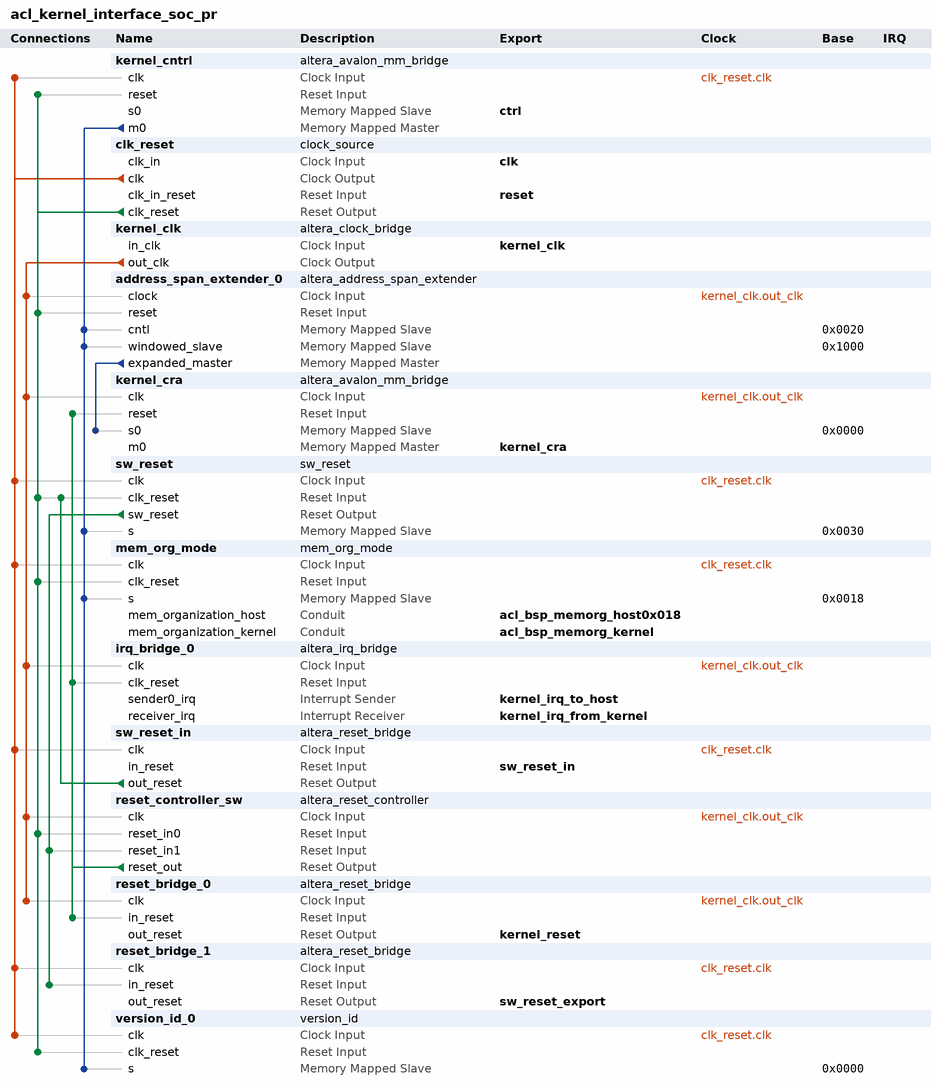
[diagram p0: system contents]
# Platform Designer (Qsys) system acl_kernel_interface_soc_pr, Arria 10 10AS066N3F40E2SG
# Parameters at their usual value, and those the tool derives, are not listed.
package require -exact qsys 1.0
create_system acl_kernel_interface_soc_pr
set_project_property DEVICE_FAMILY {Arria 10}
set_project_property DEVICE 10AS066N3F40E2SG

add_component kernel_cntrl ip/acl_kernel_interface_soc_pr/acl_kernel_interface_soc_pr_kernel_cntrl.ip altera_avalon_mm_bridge kernel_cntrl 17.1
load_component kernel_cntrl
set_component_parameter_value DATA_WIDTH 32
set_component_parameter_value ADDRESS_WIDTH 14
set_component_parameter_value USE_AUTO_ADDRESS_WIDTH 1
set_component_parameter_value ADDRESS_UNITS SYMBOLS
set_component_parameter_value MAX_PENDING_RESPONSES 1
save_component

add_component clk_reset ip/acl_kernel_interface_soc_pr/acl_kernel_interface_soc_pr_clk_reset.ip clock_source clk_reset 
load_component clk_reset
set_component_parameter_value clockFrequency 100000000
set_component_parameter_value resetSynchronousEdges DEASSERT
save_component

add_component kernel_clk ip/acl_kernel_interface_soc_pr/acl_kernel_interface_soc_pr_kernel_clk.ip altera_clock_bridge kernel_clk 17.1
load_component kernel_clk
set_component_parameter_value DERIVED_CLOCK_RATE 400000000
set_component_parameter_value EXPLICIT_CLOCK_RATE 0
save_component

add_component address_span_extender_0 ip/acl_kernel_interface_soc_pr/acl_kernel_interface_soc_pr_address_span_extender_0.ip altera_address_span_extender address_span_extender_0 17.1
load_component address_span_extender_0
set_component_parameter_value DATA_WIDTH 32
set_component_parameter_value MASTER_ADDRESS_WIDTH 30
set_component_parameter_value SLAVE_ADDRESS_WIDTH 10
set_component_parameter_value BURSTCOUNT_WIDTH 1
set_component_parameter_value MASTER_ADDRESS_DEF 0
set_component_parameter_value ENABLE_SLAVE_PORT true
set_component_parameter_value MAX_PENDING_READS 1
save_component

add_component kernel_cra ip/acl_kernel_interface_soc_pr/acl_kernel_interface_soc_pr_kernel_cra.ip altera_avalon_mm_bridge kernel_cra 17.1
load_component kernel_cra
set_component_parameter_value DATA_WIDTH 64
set_component_parameter_value ADDRESS_WIDTH 30
set_component_parameter_value USE_AUTO_ADDRESS_WIDTH 0
set_component_parameter_value ADDRESS_UNITS SYMBOLS
set_component_parameter_value MAX_PENDING_RESPONSES 1
save_component

add_component sw_reset ip/acl_kernel_interface_soc_pr/acl_kernel_interface_soc_pr_sw_reset.ip sw_reset sw_reset 10.0
load_component sw_reset
set_component_parameter_value WIDTH 64
set_component_parameter_value LOG2_RESET_CYCLES 10
set_component_parameter_value WIDTH_BYTES 8
save_component

add_component mem_org_mode ip/acl_kernel_interface_soc_pr/acl_kernel_interface_soc_pr_mem_org_mode.ip mem_org_mode mem_org_mode 10.0
load_component mem_org_mode
set_component_parameter_value WIDTH 32
save_component

add_component irq_bridge_0 ip/acl_kernel_interface_soc_pr/acl_kernel_interface_soc_pr_irq_bridge_0.ip altera_irq_bridge irq_bridge_0 17.1
load_component irq_bridge_0
set_component_parameter_value IRQ_WIDTH 1
save_component

add_component sw_reset_in ip/acl_kernel_interface_soc_pr/acl_kernel_interface_soc_pr_sw_reset_in.ip altera_reset_bridge sw_reset_in 17.1
load_component sw_reset_in
set_component_parameter_value ACTIVE_LOW_RESET 0
set_component_parameter_value SYNCHRONOUS_EDGES deassert
save_component

add_component reset_controller_sw ip/acl_kernel_interface_soc_pr/acl_kernel_interface_soc_pr_reset_controller_sw.ip altera_reset_controller reset_controller_sw 17.1
load_component reset_controller_sw
set_component_parameter_value NUM_RESET_INPUTS 2
set_component_parameter_value SYNC_DEPTH 2
set_component_parameter_value ADAPT_RESET_REQUEST 0
save_component

add_component reset_bridge_0 ip/acl_kernel_interface_soc_pr/acl_kernel_interface_soc_pr_reset_bridge_0.ip altera_reset_bridge reset_bridge_0 17.1
load_component reset_bridge_0
set_component_parameter_value ACTIVE_LOW_RESET 1
set_component_parameter_value SYNCHRONOUS_EDGES deassert
save_component

add_component reset_bridge_1 ip/acl_kernel_interface_soc_pr/acl_kernel_interface_soc_pr_reset_bridge_1.ip altera_reset_bridge reset_bridge_1 17.1
load_component reset_bridge_1
set_component_parameter_value ACTIVE_LOW_RESET 1
set_component_parameter_value SYNCHRONOUS_EDGES deassert
save_component

add_component version_id_0 ip/acl_kernel_interface_soc_pr/acl_kernel_interface_soc_pr_version_id_0.ip version_id version_id_0 10.0
load_component version_id_0
set_component_parameter_value WIDTH 32
set_component_parameter_value VERSION_ID -1598029822
save_component

# connections
add_connection clk_reset.clk kernel_cntrl.clk clock
add_connection clk_reset.clk mem_org_mode.clk clock
add_connection clk_reset.clk reset_bridge_1.clk clock
add_connection clk_reset.clk sw_reset.clk clock
add_connection clk_reset.clk sw_reset_in.clk clock
add_connection clk_reset.clk version_id_0.clk clock
add_connection kernel_clk.out_clk address_span_extender_0.clock clock
add_connection kernel_clk.out_clk irq_bridge_0.clk clock
add_connection kernel_clk.out_clk kernel_cra.clk clock
add_connection kernel_clk.out_clk reset_bridge_0.clk clock
add_connection kernel_clk.out_clk reset_controller_sw.clk clock
add_connection clk_reset.clk_reset address_span_extender_0.reset reset
add_connection clk_reset.clk_reset kernel_cntrl.reset reset
add_connection clk_reset.clk_reset mem_org_mode.clk_reset reset
add_connection clk_reset.clk_reset reset_controller_sw.reset_in0 reset
add_connection clk_reset.clk_reset sw_reset.clk_reset reset
add_connection clk_reset.clk_reset version_id_0.clk_reset reset
add_connection reset_controller_sw.reset_out irq_bridge_0.clk_reset reset
add_connection reset_controller_sw.reset_out kernel_cra.reset reset
add_connection reset_controller_sw.reset_out reset_bridge_0.in_reset reset
add_connection sw_reset.sw_reset reset_bridge_1.in_reset reset
add_connection sw_reset.sw_reset reset_controller_sw.reset_in1 reset
add_connection sw_reset_in.out_reset sw_reset.clk_reset reset
add_connection address_span_extender_0.expanded_master kernel_cra.s0 avalon
set_connection_parameter_value address_span_extender_0.expanded_master/kernel_cra.s0 baseAddress 0x0000
add_connection kernel_cntrl.m0 address_span_extender_0.cntl avalon
set_connection_parameter_value kernel_cntrl.m0/address_span_extender_0.cntl baseAddress 0x0020
add_connection kernel_cntrl.m0 address_span_extender_0.windowed_slave avalon
set_connection_parameter_value kernel_cntrl.m0/address_span_extender_0.windowed_slave baseAddress 0x1000
add_connection kernel_cntrl.m0 mem_org_mode.s avalon
set_connection_parameter_value kernel_cntrl.m0/mem_org_mode.s baseAddress 0x0018
add_connection kernel_cntrl.m0 sw_reset.s avalon
set_connection_parameter_value kernel_cntrl.m0/sw_reset.s baseAddress 0x0030
add_connection kernel_cntrl.m0 version_id_0.s avalon
set_connection_parameter_value kernel_cntrl.m0/version_id_0.s baseAddress 0x0000

# exported interfaces
add_interface acl_bsp_memorg_host0x018 conduit end
set_interface_property acl_bsp_memorg_host0x018 EXPORT_OF mem_org_mode.mem_organization_host
add_interface acl_bsp_memorg_kernel conduit end
set_interface_property acl_bsp_memorg_kernel EXPORT_OF mem_org_mode.mem_organization_kernel
add_interface clk clock sink
set_interface_property clk EXPORT_OF clk_reset.clk_in
add_interface ctrl avalon slave
set_interface_property ctrl EXPORT_OF kernel_cntrl.s0
add_interface kernel_clk clock sink
set_interface_property kernel_clk EXPORT_OF kernel_clk.in_clk
add_interface kernel_cra avalon master
set_interface_property kernel_cra EXPORT_OF kernel_cra.m0
add_interface kernel_irq_from_kernel interrupt receiver
set_interface_property kernel_irq_from_kernel EXPORT_OF irq_bridge_0.receiver_irq
add_interface kernel_irq_to_host interrupt sender
set_interface_property kernel_irq_to_host EXPORT_OF irq_bridge_0.sender0_irq
add_interface kernel_reset reset source
set_interface_property kernel_reset EXPORT_OF reset_bridge_0.out_reset
add_interface reset reset sink
set_interface_property reset EXPORT_OF clk_reset.clk_in_reset
add_interface sw_reset_export reset source
set_interface_property sw_reset_export EXPORT_OF reset_bridge_1.out_reset
add_interface sw_reset_in reset sink
set_interface_property sw_reset_in EXPORT_OF sw_reset_in.in_reset

set_interconnect_requirement {$system} qsys_mm.clockCrossingAdapter HANDSHAKE
set_interconnect_requirement {$system} qsys_mm.maxAdditionalLatency 0

save_system acl_kernel_interface_soc_pr.qsys
